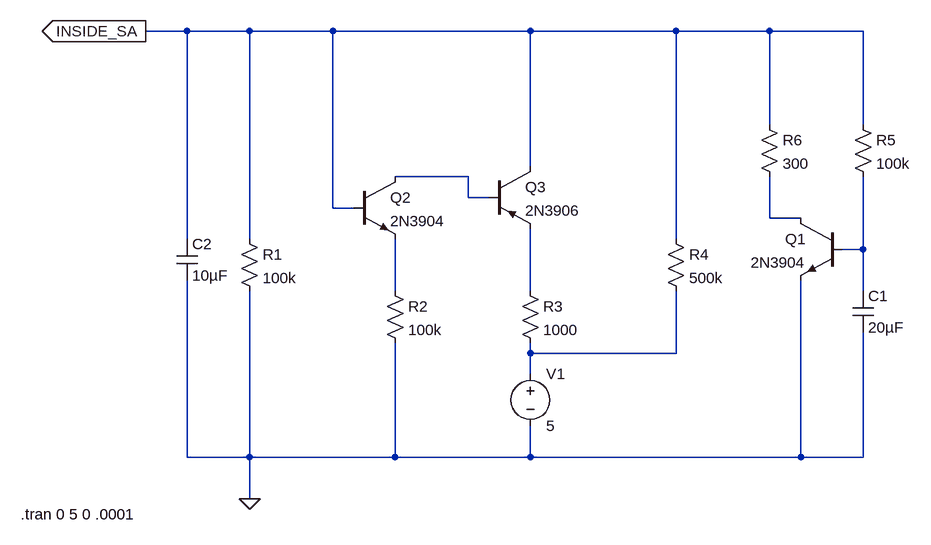
[diagram p0: schematic Pacemaker for Human Heart  SA Node.asc]
Pacemaker for Human Heart  SA Node.asc, the LTspice schematic file:
Version 4
SHEET 1 880 680
WIRE -352 -96 -416 -96
WIRE -256 -96 -352 -96
WIRE -128 -96 -256 -96
WIRE 176 -96 -128 -96
WIRE 400 -96 176 -96
WIRE 544 -96 400 -96
WIRE 688 -96 544 -96
WIRE 544 48 544 -96
WIRE 688 48 688 -96
WIRE 176 112 176 -96
WIRE 80 128 -32 128
WIRE 80 160 80 128
WIRE 112 160 80 160
WIRE -128 176 -128 -96
WIRE -96 176 -128 176
WIRE 544 192 544 128
WIRE 592 192 544 192
WIRE -352 224 -352 -96
WIRE -256 224 -256 -96
WIRE 400 224 400 -96
WIRE 688 240 688 128
WIRE 688 240 656 240
WIRE -32 304 -32 224
WIRE 176 304 176 208
WIRE 688 304 688 240
WIRE 176 400 176 384
WIRE 400 400 400 304
WIRE 400 400 176 400
WIRE 176 432 176 400
WIRE -352 560 -352 288
WIRE -256 560 -256 304
WIRE -256 560 -352 560
WIRE -32 560 -32 384
WIRE -32 560 -256 560
WIRE 176 560 176 512
WIRE 176 560 -32 560
WIRE 592 560 592 288
WIRE 592 560 176 560
WIRE 688 560 688 368
WIRE 688 560 592 560
WIRE -256 624 -256 560
FLAG -256 624 0
FLAG -416 -96 INSIDE_SA
IOPIN -416 -96 Out
SYMBOL pnp 112 112 R0
SYMATTR InstName Q3
SYMATTR Value 2N3906
SYMBOL npn -96 128 R0
SYMATTR InstName Q2
SYMATTR Value 2N3904
SYMBOL res 160 288 R0
SYMATTR InstName R3
SYMATTR Value 1000
SYMBOL res -48 288 R0
SYMATTR InstName R2
SYMATTR Value 100k
SYMBOL voltage 176 416 R0
WINDOW 123 0 0 Left 0
WINDOW 39 0 0 Left 0
SYMATTR InstName V1
SYMATTR Value 5
SYMBOL res 384 208 R0
SYMATTR InstName R4
SYMATTR Value 500k
SYMBOL cap -368 224 R0
SYMATTR InstName C2
SYMATTR Value 10µF
SYMBOL res -272 208 R0
SYMATTR InstName R1
SYMATTR Value 100k
SYMBOL res 528 32 R0
SYMATTR InstName R6
SYMATTR Value 300
SYMBOL res 672 32 R0
SYMATTR InstName R5
SYMATTR Value 100k
SYMBOL cap 672 304 R0
SYMATTR InstName C1
SYMATTR Value 20µF
SYMBOL npn 656 192 M0
SYMATTR InstName Q1
SYMATTR Value 2N3904
TEXT -608 648 Left 2 !.tran 0 5 0 .0001

The netlist it stands for:
* Pacemaker for Human Heart  SA Node.asc
Q3 INSIDE_SA N001 N005 0 2N3906
Q2 N001 INSIDE_SA N004 0 2N3904
R3 N005 N006 1000
R2 N004 0 100k
V1 N006 0 5
R4 INSIDE_SA N006 500k
C2 INSIDE_SA 0 10µF
R1 INSIDE_SA 0 100k
R6 INSIDE_SA N002 300
R5 INSIDE_SA N003 100k
C1 N003 0 20µF
Q1 N002 N003 0 0 2N3904
.model NPN NPN
.model PNP PNP
.lib standard.bjt
.tran 0 5 0 .0001
.backanno
.end